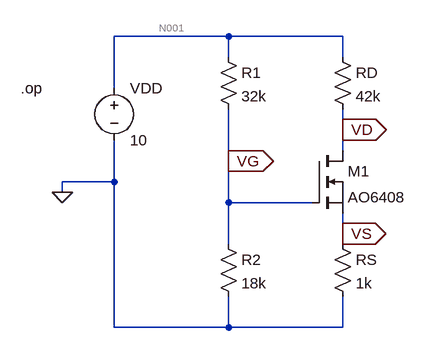
[diagram p0: schematic prob3_26.asc]
prob3_26.asc, the LTspice schematic file:
Version 4
SHEET 1 880 680
WIRE 256 -16 80 -16
WIRE 432 -16 256 -16
WIRE 256 16 256 -16
WIRE 432 16 432 -16
WIRE 80 64 80 -16
WIRE 432 128 432 96
WIRE 432 160 432 128
WIRE 256 176 256 96
WIRE 80 208 80 144
WIRE 80 208 0 208
WIRE 0 224 0 208
WIRE 256 240 256 176
WIRE 384 240 256 240
WIRE 432 288 432 256
WIRE 256 304 256 240
WIRE 432 304 432 288
WIRE 80 432 80 208
WIRE 256 432 256 384
WIRE 256 432 80 432
WIRE 432 432 432 384
WIRE 432 432 256 432
FLAG 0 224 0
FLAG 256 176 VG
IOPIN 256 176 Out
FLAG 432 128 VD
IOPIN 432 128 Out
FLAG 432 288 VS
IOPIN 432 288 Out
SYMBOL voltage 80 48 R0
SYMATTR InstName VDD
SYMATTR Value 10
SYMBOL res 240 0 R0
SYMATTR InstName R1
SYMATTR Value 32k
SYMBOL res 240 288 R0
SYMATTR InstName R2
SYMATTR Value 18k
SYMBOL res 416 0 R0
SYMATTR InstName RD
SYMATTR Value 42k
SYMBOL res 416 288 R0
SYMATTR InstName RS
SYMATTR Value 1k
SYMBOL nmos 384 160 R0
SYMATTR InstName M1
SYMATTR Value AO6408
TEXT -64 64 Left 2 !.op

The netlist it stands for:
* prob3_26.asc
VDD N001 0 10
R1 N001 VG 32k
R2 VG 0 18k
RD N001 VD 42k
RS VS 0 1k
M1 VD VG VS VS AO6408
.model NMOS NMOS
.model PMOS PMOS
.lib standard.mos
.op
.backanno
.end

* Results of the author's LTspice run, read from the files saved beside the schematic
* Operating Point:
*   V(n001) = 10 V
*   V(vg) = 3.6 V
*   V(vd) = 232.6 mV
*   V(vs) = 232.6 mV
*   Id(M1) = 232.6 µA
*   Ig(M1) = -699.6 pA
*   Is(M1) = -232.6 µA
*   I(R1) = 200 µA
*   I(R2) = 200 µA
*   I(Rd) = 232.6 µA
*   I(Rs) = 232.6 µA
*   I(Vdd) = -432.6 µA